# EasyEDA schematic SCH_Display_EasyEDA.json
TITLE: Arduino; REV: 2.0; Date: 2024-09-28; Sheet: 1/3; Drawn By: mromanini; Company: Your Company
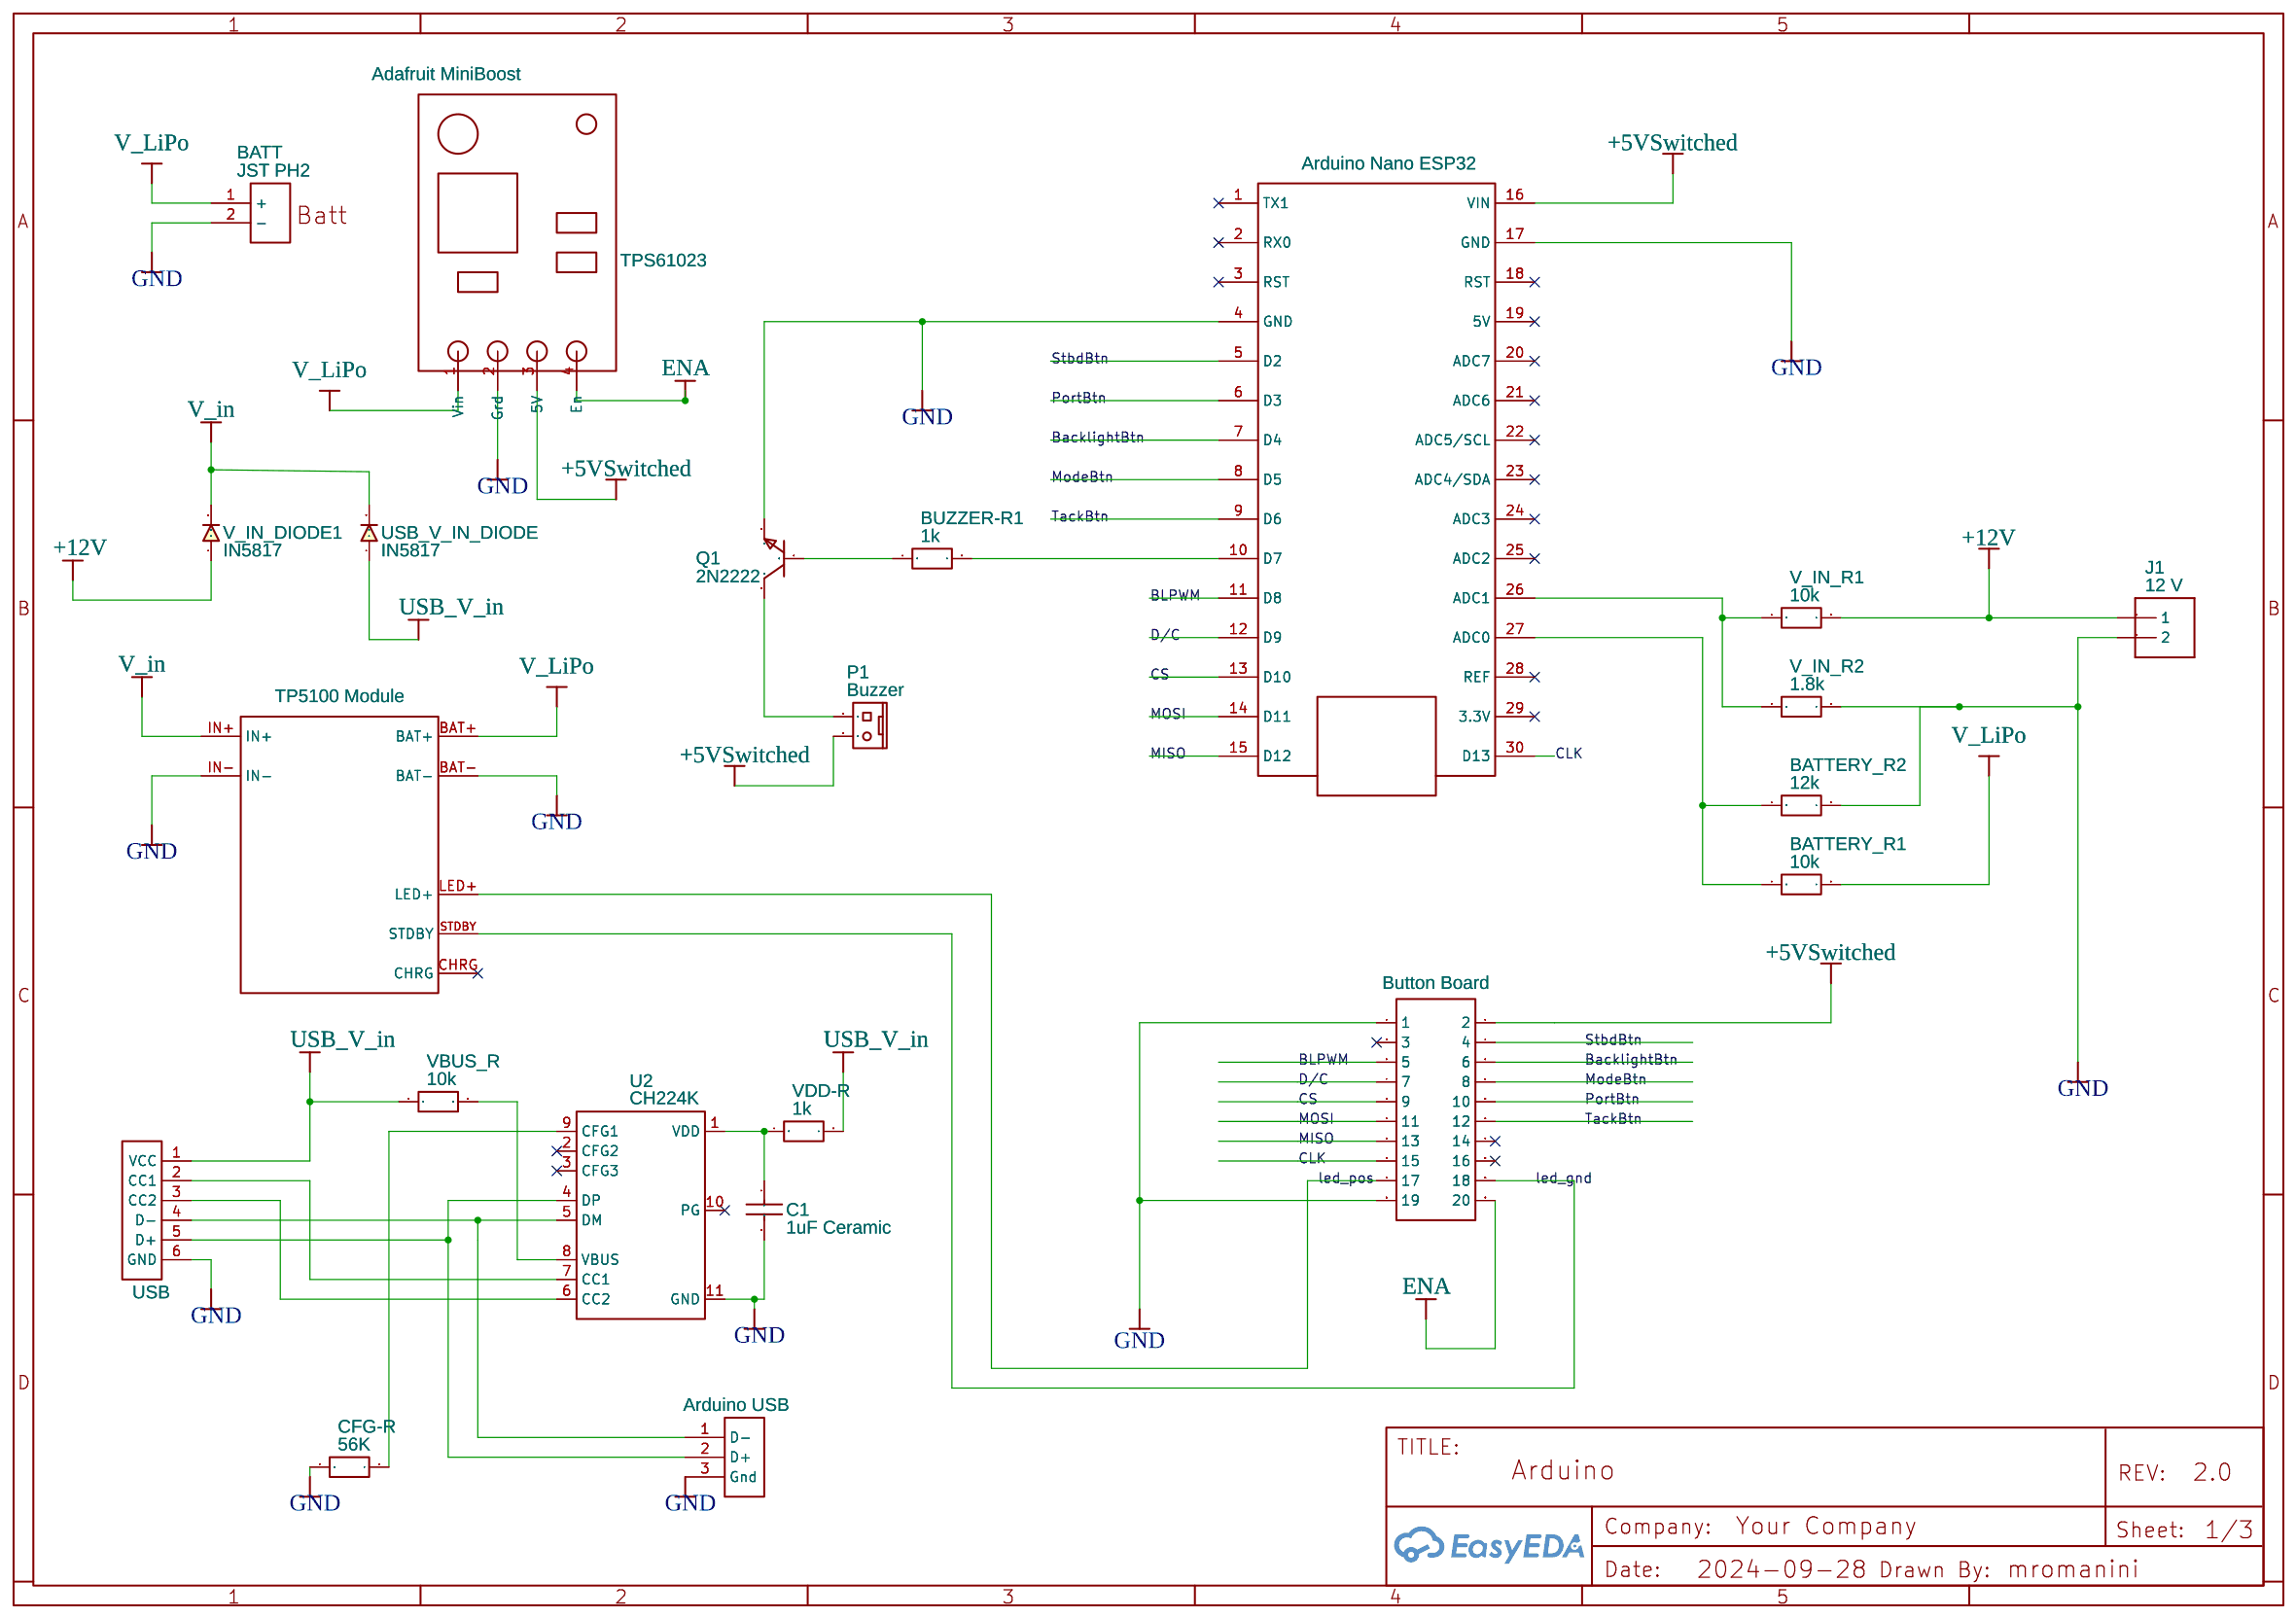
[diagram p0: schematic sheet]

## Parts
BATT  JST PH2  [JST-PH-JST-PH2]
BATTERY_R1  10k  [1K 0.25W]
BATTERY_R2  12k  [1K 0.25W]
BUTTON_LED1  Button Board  [HDR-M-2.54_2X10]
BUZZER-R1  1k  [1K 0.25W]
C1  1uF Ceramic  [CERAMIC CAPACITOR]
CFG-R  56K  [1K 0.25W]
J1  12 V  [1X2-3.5MM]
JST-PH-2.0_1X6  USB  [JST-PH-2.0_1X6]
JST_XH_1X3  Arduino USB  [JST XH 1X3]
P1  Buzzer  [HDR-1X2M-P-2.54MM-JST XH NO]
Q1  2N2222  [TO-92-3_L4.9-W3.7-P1.27-L]
TPS61023  Adafruit MiniBoost  [ADAFRUIT MINIBOOST 5V @ 1A - TPS61023 FOOTPRINT]
U1  Arduino Nano ESP32  [ADUINO NANO R3]
U2  CH224K  [ESSOP-10_L4.9-W3.9-P1.0-LS6.0-TL-EP]
U3  TP5100 Module  [TP5100-MODULE]
USB_V_IN_DIODE  IN5817  [DIODE NI RAMON]
V_IN_DIODE1  IN5817  [DIODE NI RAMON]
V_IN_R1  10k  [1K 0.25W]
V_IN_R2  1.8k  [1K 0.25W]
VBUS_R  10k  [1K 0.25W]
VDD-R  1k  [1K 0.25W]

## Library data of the parts
BATT = JST PH2: Contributor: pwarrow99
BATTERY_R1 BATTERY_R2 BUZZER-R1 CFG-R V_IN_R1 V_IN_R2 VBUS_R VDD-R = 1w resistor: Contributor: Kagutsuchi
BUTTON_LED1 = HDR-M-2.54_2x10: Supplier Part: C124359; Supplier: LCSC; Contributor: LCEDA_Lib
C1 = Capacitor_Ceramic: Contributor: huuvinhz755
J1 = TERMBLOCK_1X2-3.5MM: Contributor: Adafruit
JST-PH-2.0_1X6 = JST-PH-2.0_1x6: Contributor: yury26nev
JST_XH_1X3 = JST XH 1x3: Contributor: GeMeMe
P1 = HDR-2.54_1x2_N_O: Supplier: LCSC; Manufacturer Part: Headers  Pins2.54mm1*10P; image: http://image.lceda.cn/szlcsc/C57369.jpg; Supplier Part: C57369; Contributor: jousterde1
Q1 = 2N2222: Contributor: LCSC; Supplier: LCSC; Manufacturer: ST(先科); Manufacturer Part: 2N2222A; Supplier Part: C118536; JLCPCB Part Class: Extended Part
TPS61023 = Adafruit MiniBoost 5V @ 1A - TPS61023: Contributor: jefflorditch
U1 = ARDUINO_NANO_R3: Contributor: Nikolay Yanev
U2 = CH224K: Contributor: lcsc; Supplier: LCSC; Supplier Part: C970725; Manufacturer: WCH(南京沁恒); JLCPCB Part Class: Extended Part
U3 = TP5100-MODULE: Contributor: cropemail
USB_V_IN_DIODE V_IN_DIODE1 = in5004 diode: Manufacturer Part: DIODE; Contributor: mimit.oscar

## Nets
+5VSwitched: BUTTON_LED1.2 P1.2 TPS61023.3(5V) U1.16(VIN)
+12V: J1.1 V_IN_DIODE1.1 V_IN_R1.2(1)
GND: BATT.2(-) BATTERY_R2.2(1) BUTTON_LED1.1 BUTTON_LED1.19 C1.2 CFG-R.1(2) J1.2 JST-PH-2.0_1X6.6(GND) JST_XH_1X3.3(Gnd) Q1.1(E) TPS61023.2(Grd) U1.4(GND) U1.17(GND) U2.11(GND) U3.BAT- U3.IN- V_IN_R2.2(1)
BacklightBtn: BUTTON_LED1.6 U1.7(D4)
BLPWM: BUTTON_LED1.5 U1.11(D8)
CLK: BUTTON_LED1.15 U1.30(D13)
CS: BUTTON_LED1.9 U1.13(D10)
D/C: BUTTON_LED1.7 U1.12(D9)
ENA: BUTTON_LED1.20 TPS61023.4(En)
led_gnd: BUTTON_LED1.18 U3.STDBY
led_pos: BUTTON_LED1.17 U3.LED+
MISO: BUTTON_LED1.13 U1.15(D12)
ModeBtn: BUTTON_LED1.8 U1.8(D5)
MOSI: BUTTON_LED1.11 U1.14(D11)
PortBtn: BUTTON_LED1.10 U1.6(D3)
StbdBtn: BUTTON_LED1.4 U1.5(D2)
TackBtn: BUTTON_LED1.12 U1.9(D6)
USB_V_in: JST-PH-2.0_1X6.1(VCC) USB_V_IN_DIODE.1 VBUS_R.1(2) VDD-R.2(1)
V_in: U3.IN+ USB_V_IN_DIODE.2 V_IN_DIODE1.2
V_LiPo: BATT.1(+) BATTERY_R1.2(1) TPS61023.1(Vin) U3.BAT+
Net-(BATTERY_R1-1): BATTERY_R1.1(2) BATTERY_R2.1(2) U1.27(ADC0)
Net-(BUZZER-R1-1): BUZZER-R1.1(2) Q1.2(B)
Net-(BUZZER-R1-2): BUZZER-R1.2(1) U1.10(D7)
Net-(C1-1): C1.1 U2.1(VDD) VDD-R.1(2)
Net-(CFG-R-2): CFG-R.2(1) U2.9(CFG1)
Net-(JST-PH-2.0_1X6-2): JST-PH-2.0_1X6.2(CC1) U2.7(CC1)
Net-(JST-PH-2.0_1X6-3): JST-PH-2.0_1X6.3(CC2) U2.6(CC2)
Net-(JST-PH-2.0_1X6-4): JST-PH-2.0_1X6.4(D-) JST_XH_1X3.1(D-) U2.5(DM)
Net-(JST-PH-2.0_1X6-5): JST-PH-2.0_1X6.5(D+) JST_XH_1X3.2(D+) U2.4(DP)
Net-(P1-1): P1.1 Q1.3(C)
Net-(U1-26): U1.26(ADC1) V_IN_R1.1(2) V_IN_R2.1(2)
Net-(U2-8): U2.8(VBUS) VBUS_R.2(1)

Not connected (* = marked no-connect by the designer): BUTTON_LED1 3* 14* 16*; U1 1(TX1)* 2(RX0)* 3(RST)* 18(RST)* 19(5V)* 20(ADC7)* 21(ADC6)* 22(ADC5/SCL)* 23(ADC4/SDA)* 24(ADC3)* 25(ADC2)* 28(REF)* 29(3.3V)*; U2 2(CFG2)* 3(CFG3)* 10(PG)*; U3 CHRG*
